# Altium schematic sheet [04] - SIGNAL BLOCK DIAGRAM_ASCII.SchDoc: Signal Block Diagram
size Letter; SheetNumber: 4; SheetTotal: 4
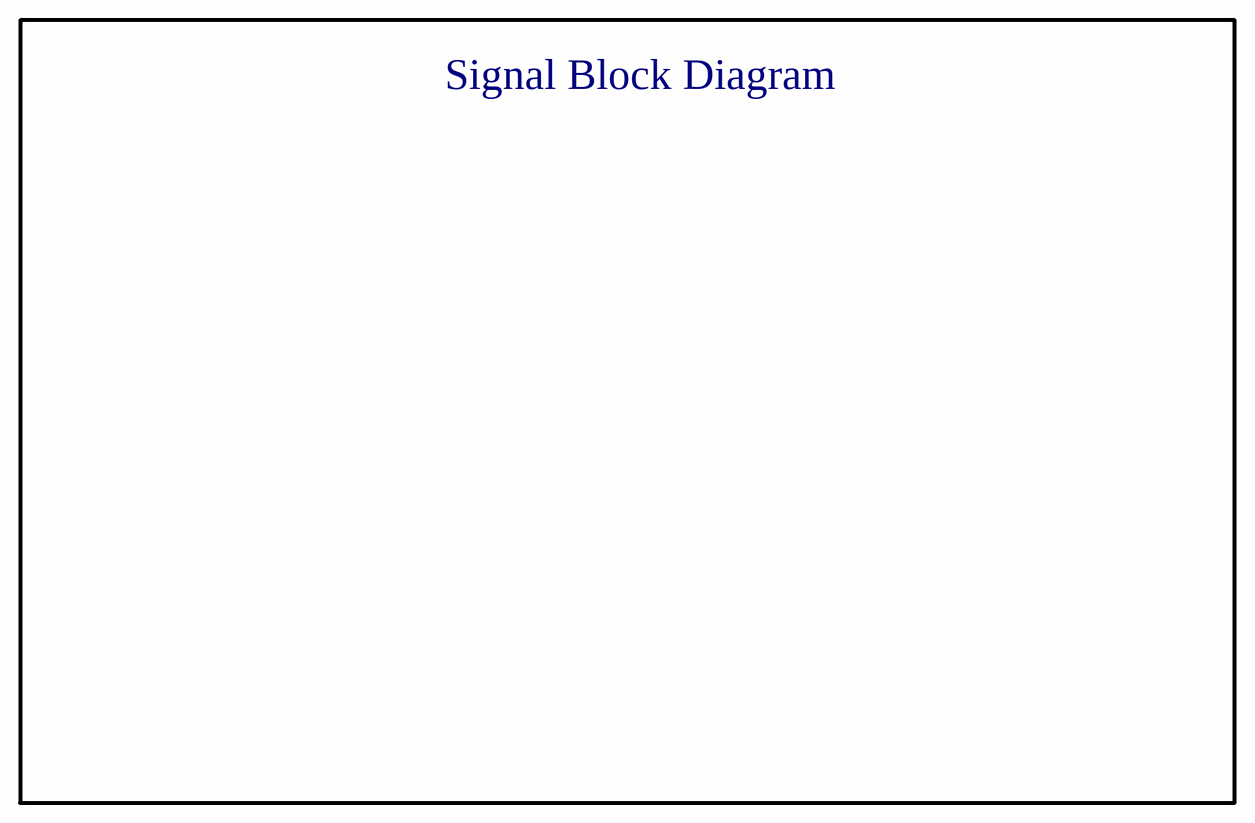
[diagram p0: [04] - SIGNAL BLOCK DIAGRAM_ASCII.SchDoc]

## Notes on the sheet
- Signal Block Diagram
- CONFIDENTIALITY NOTICE. THIS DRAWING AND INFORMATION CONTAINED HEREIN ARE THE EXCLUSIVE PROPERTY OF [[INSERT COMPANY NAME]]. NEITHER THIS DESIGN NOR ANY INFORMATION CONTAINED IN THIS DRAWING MAY BE REPRODUCED OR DISCLOSED WITHOUT THE EXPRESS WRITTEN CONSENT OF [[INSERT COMPANY NAME]].
- PCB Part Number:
- PCB Rev.:
- PCB Variant:
- Replaces PCB P/N & Rev.:
- SHEET TITLE:
- SIZE
- A
- Time Stamp:
- Doc. No.:
- Doc. Rev.:
- Doc. Status:
- Sheet
- of